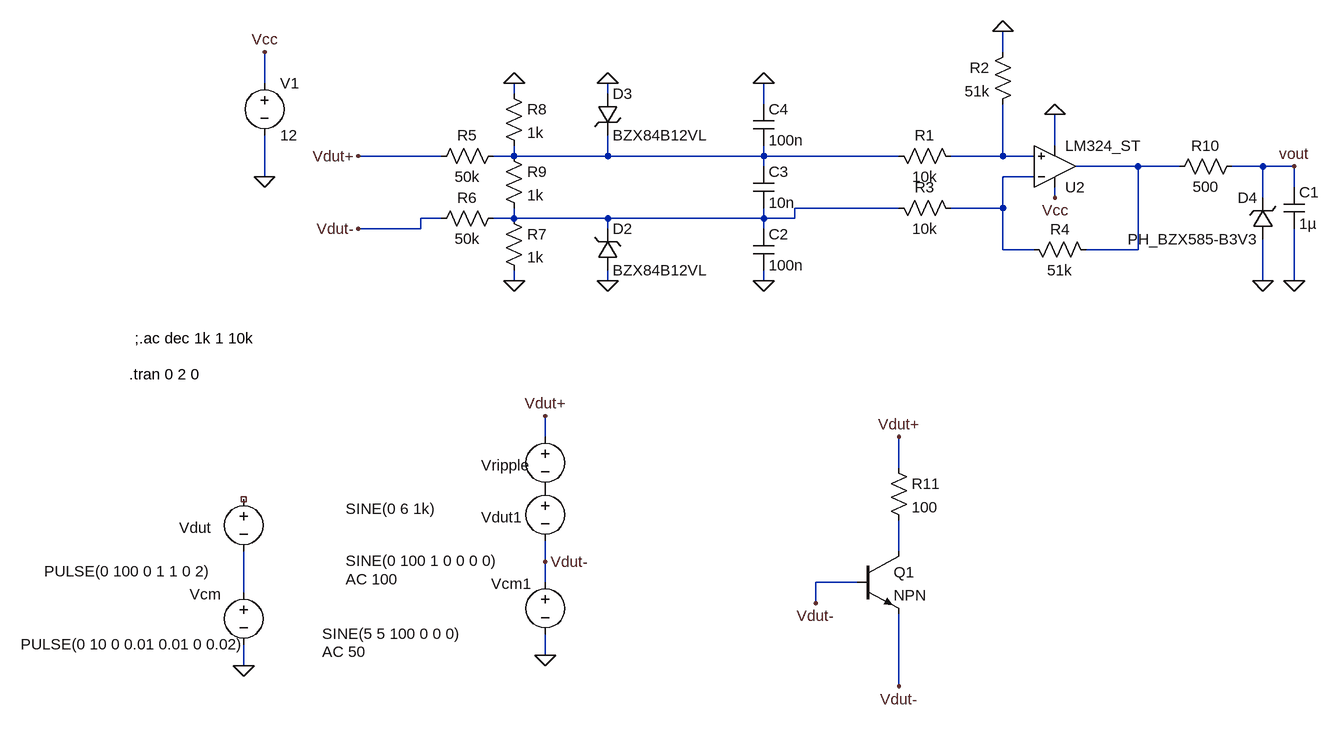
[diagram p0: schematic voltage.asc]
voltage.asc, the LTspice schematic file:
Version 4
SHEET 1 1036 988
WIRE 544 -96 544 -128
WIRE -592 -48 -592 -96
WIRE -208 -32 -208 -48
WIRE -64 -32 -64 -48
WIRE 176 -16 176 -48
WIRE 624 48 624 0
WIRE -320 64 -448 64
WIRE -208 64 -208 48
WIRE -208 64 -240 64
WIRE -64 64 -64 32
WIRE -64 64 -208 64
WIRE 176 64 176 48
WIRE 176 64 -64 64
WIRE 384 64 176 64
WIRE 544 64 544 -16
WIRE 544 64 464 64
WIRE 592 64 544 64
WIRE 176 80 176 64
WIRE 752 80 656 80
WIRE 816 80 752 80
WIRE 944 80 896 80
WIRE 992 80 944 80
WIRE -592 96 -592 32
WIRE 592 96 544 96
WIRE 992 112 992 80
WIRE 624 128 624 112
WIRE 944 128 944 80
WIRE 384 144 224 144
WIRE 544 144 544 96
WIRE 544 144 464 144
WIRE -320 160 -352 160
WIRE -208 160 -208 144
WIRE -208 160 -240 160
WIRE -64 160 -208 160
WIRE 176 160 176 144
WIRE 176 160 -64 160
WIRE 224 160 224 144
WIRE 224 160 176 160
WIRE -352 176 -352 160
WIRE -352 176 -448 176
WIRE -64 176 -64 160
WIRE 176 176 176 160
WIRE 544 208 544 144
WIRE 592 208 544 208
WIRE 752 208 752 80
WIRE 752 208 672 208
WIRE -208 256 -208 240
WIRE -64 256 -64 240
WIRE 176 256 176 240
WIRE 944 256 944 192
WIRE 992 256 992 176
WIRE -160 496 -160 464
WIRE 384 544 384 496
WIRE 384 672 384 624
WIRE -160 688 -160 656
WIRE -160 720 -160 688
WIRE 320 720 256 720
WIRE -624 736 -624 672
WIRE 256 752 256 720
WIRE -160 832 -160 800
WIRE -624 848 -624 816
WIRE 384 880 384 768
FLAG 544 -128 0
FLAG 624 0 0
FLAG -592 -96 Vcc
FLAG -592 96 0
FLAG 624 128 Vcc
FLAG -624 848 0
FLAG -208 256 0
FLAG -208 -48 0
FLAG 992 80 vout
FLAG -64 -48 0
FLAG -64 256 0
FLAG 992 256 0
FLAG -448 176 Vdut-
FLAG -448 64 Vdut+
FLAG -160 832 0
FLAG -160 688 Vdut-
FLAG -160 464 Vdut+
FLAG 944 256 0
FLAG 176 -48 0
FLAG 176 256 0
FLAG 384 496 Vdut+
FLAG 384 880 Vdut-
FLAG 256 752 Vdut-
SYMBOL res 480 80 M270
WINDOW 0 32 56 VTop 2
WINDOW 3 0 56 VBottom 2
SYMATTR InstName R1
SYMATTR Value 10k
SYMBOL res 560 -112 M0
SYMATTR InstName R2
SYMATTR Value 51k
SYMBOL res 368 128 M90
WINDOW 0 0 56 VBottom 2
WINDOW 3 32 56 VTop 2
SYMATTR InstName R3
SYMATTR Value 10k
SYMBOL res 576 192 M90
WINDOW 0 0 56 VBottom 2
WINDOW 3 32 56 VTop 2
SYMATTR InstName R4
SYMATTR Value 51k
SYMBOL voltage -592 -64 R0
WINDOW 123 0 0 Left 0
WINDOW 39 0 0 Left 0
SYMATTR InstName V1
SYMATTR Value 12
SYMBOL voltage -624 576 R0
WINDOW 0 -99 60 Left 2
WINDOW 3 -307 127 Left 2
WINDOW 123 0 0 Left 0
WINDOW 39 0 0 Left 0
SYMATTR InstName Vdut
SYMATTR Value PULSE(0 100 0 1 1 0 2)
SYMBOL voltage -624 720 R0
WINDOW 0 -83 18 Left 2
WINDOW 3 -343 95 Left 2
WINDOW 123 0 0 Left 0
WINDOW 39 0 0 Left 0
SYMATTR InstName Vcm
SYMATTR Value PULSE(0 10 0 0.01 0.01 0 0.02)
SYMBOL res -224 48 R90
WINDOW 0 0 56 VBottom 2
WINDOW 3 32 56 VTop 2
SYMATTR InstName R5
SYMATTR Value 50k
SYMBOL res -224 144 R90
WINDOW 0 0 56 VBottom 2
WINDOW 3 32 56 VTop 2
SYMATTR InstName R6
SYMATTR Value 50k
SYMBOL res -224 144 R0
SYMATTR InstName R7
SYMATTR Value 1k
SYMBOL res -224 -48 R0
SYMATTR InstName R8
SYMATTR Value 1k
SYMBOL res -224 48 R0
SYMATTR InstName R9
SYMATTR Value 1k
SYMBOL zener -80 -32 R0
SYMATTR InstName D3
SYMATTR Value BZX84B12VL
SYMATTR Description Diode
SYMATTR Type diode
SYMBOL zener -80 240 M180
WINDOW 0 24 64 Left 2
WINDOW 3 24 0 Left 2
SYMATTR InstName D2
SYMATTR Value BZX84B12VL
SYMATTR Description Diode
SYMATTR Type diode
SYMBOL res 912 64 R90
WINDOW 0 0 56 VBottom 2
WINDOW 3 32 56 VTop 2
SYMATTR InstName R10
SYMATTR Value 500
SYMBOL cap 976 112 R0
SYMATTR InstName C1
SYMATTR Value 1µ
SYMBOL voltage -160 560 R0
WINDOW 0 -99 60 Left 2
WINDOW 3 -307 127 Left 2
WINDOW 123 -307 155 Left 2
WINDOW 39 0 0 Left 0
SYMATTR InstName Vdut1
SYMATTR Value SINE(0 100 1 0 0 0 0)
SYMATTR Value2 AC 100
SYMBOL voltage -160 704 R0
WINDOW 0 -83 18 Left 2
WINDOW 3 -343 95 Left 2
WINDOW 123 -343 123 Left 2
WINDOW 39 0 0 Left 0
SYMATTR InstName Vcm1
SYMATTR Value SINE(5 5 100 0 0 0)
SYMATTR Value2 AC 50
SYMBOL voltage -160 480 R0
WINDOW 0 -99 60 Left 2
WINDOW 3 -307 127 Left 2
WINDOW 123 0 0 Left 0
WINDOW 39 0 0 Left 0
SYMATTR InstName Vripple
SYMATTR Value SINE(0 6 1k)
SYMBOL zener 960 192 R180
WINDOW 0 24 64 Left 2
WINDOW 3 24 0 Left 2
SYMATTR InstName D4
SYMATTR Value PH_BZX585-B3V3
SYMATTR Description Diode
SYMATTR Type diode
SYMBOL res 368 528 R0
SYMATTR InstName R11
SYMATTR Value 100
SYMBOL npn 320 672 R0
SYMATTR InstName Q1
SYMBOL EXTRA\\ExtraOpamps\\LM324_ST 624 80 M180
SYMATTR InstName U2
SYMBOL cap 160 176 R0
SYMATTR InstName C2
SYMATTR Value 100n
SYMBOL cap 160 80 R0
SYMATTR InstName C3
SYMATTR Value 10n
SYMBOL cap 160 -16 R0
SYMATTR InstName C4
SYMATTR Value 100n
TEXT -792 344 Left 2 !;.ac dec 1k 1 10k
TEXT -800 400 Left 2 !.tran 0 2 0

The netlist it stands for:
* voltage.asc
R1 N002 N001 10k
R2 0 N002 51k
R3 N005 N004 10k
R4 N004 N003 51k
V1 Vcc 0 12
Vdut NC_01 N007 PULSE(0 100 0 1 1 0 2)
Vcm N007 0 PULSE(0 10 0 0.01 0.01 0 0.02)
R5 N001 Vdut+ 50k
R6 N005 Vdut- 50k
R7 N005 0 1k
R8 0 N001 1k
R9 N001 N005 1k
D3 0 N001 BZX84B12VL
D2 0 N005 BZX84B12VL
R10 vout N003 500
C1 vout 0 1µ
Vdut1 P001 Vdut- SINE(0 100 1 0 0 0 0) AC 100
Vcm1 Vdut- 0 SINE(5 5 100 0 0 0) AC 50
Vripple Vdut+ P001 SINE(0 6 1k)
D4 0 vout PH_BZX585-B3V3
R11 Vdut+ N006 100
Q1 N006 Vdut- Vdut- 0 NPN
* U2: LM324_ST (symbol EXTRA\ExtraOpamps\LM324_ST not available, pins judged from their places): In+=N002 In-=N004 V+=Vcc V-=0 OUT=N003
C2 N005 0 100n
C3 N001 N005 10n
C4 0 N001 100n
.model D D
.lib standard.dio
.model NPN NPN
.model PNP PNP
.lib standard.bjt
;.ac dec 1k 1 10k
.tran 0 2 0
.backanno
.end